# EAGLE design rfLED (EAGLE 9.2.2)
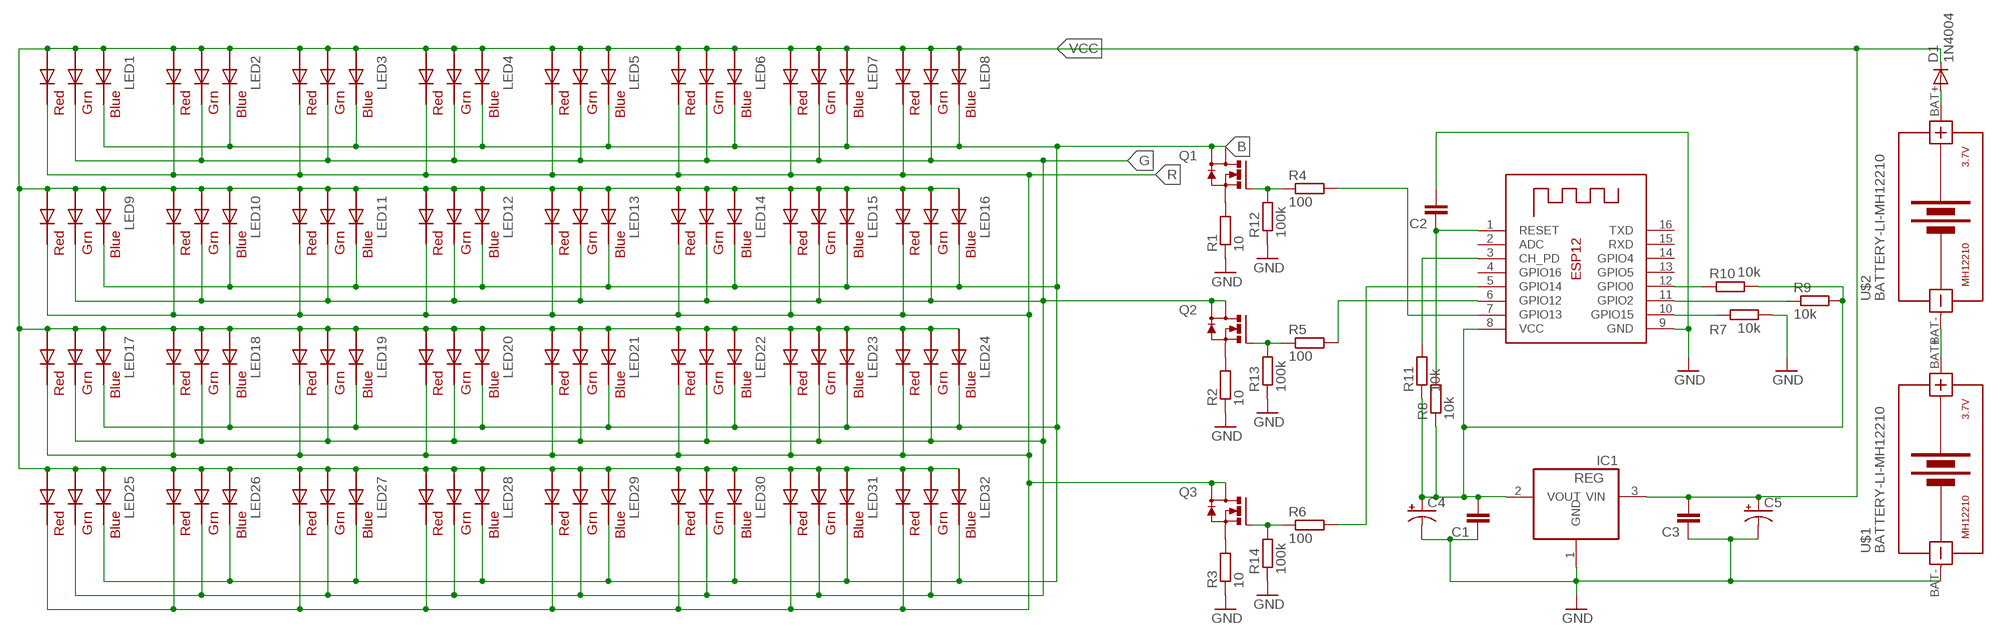
[diagram p0: schematic, sheet 1]

## Parts
C1  C  [C0805]
C2  C  [C0805]
C3  C  [C0805]
C4  CPOL-US150CLZ-1010  [150CLZ-1010]
C5  CPOL-US150CLZ-1010  [150CLZ-1010]
D1  1N4004  [DO41-10]
IC1  REG  REG1117  [SOT223]
LED1  RGBLED5050  [RGBLED5050]
LED2  RGBLED5050  [RGBLED5050]
LED3  RGBLED5050  [RGBLED5050]
LED4  RGBLED5050  [RGBLED5050]
LED5  RGBLED5050  [RGBLED5050]
LED6  RGBLED5050  [RGBLED5050]
LED7  RGBLED5050  [RGBLED5050]
LED8  RGBLED5050  [RGBLED5050]
LED9  RGBLED5050  [RGBLED5050]
LED10  RGBLED5050  [RGBLED5050]
LED11  RGBLED5050  [RGBLED5050]
LED12  RGBLED5050  [RGBLED5050]
LED13  RGBLED5050  [RGBLED5050]
LED14  RGBLED5050  [RGBLED5050]
LED15  RGBLED5050  [RGBLED5050]
LED16  RGBLED5050  [RGBLED5050]
LED17  RGBLED5050  [RGBLED5050]
LED18  RGBLED5050  [RGBLED5050]
LED19  RGBLED5050  [RGBLED5050]
LED20  RGBLED5050  [RGBLED5050]
LED21  RGBLED5050  [RGBLED5050]
LED22  RGBLED5050  [RGBLED5050]
LED23  RGBLED5050  [RGBLED5050]
LED24  RGBLED5050  [RGBLED5050]
LED25  RGBLED5050  [RGBLED5050]
LED26  RGBLED5050  [RGBLED5050]
LED27  RGBLED5050  [RGBLED5050]
LED28  RGBLED5050  [RGBLED5050]
LED29  RGBLED5050  [RGBLED5050]
LED30  RGBLED5050  [RGBLED5050]
LED31  RGBLED5050  [RGBLED5050]
LED32  RGBLED5050  [RGBLED5050]
Q1  MOSFET_N_SOT223  [SOT223]
Q2  MOSFET_N_SOT223  [SOT223]
Q3  MOSFET_N_SOT223  [SOT223]
R1  10  RR2512  [R2512]
R2  10  RR2512  [R2512]
R3  10  RR2512  [R2512]
R4  100  RR1206  [R1206]
R5  100  RR1206  [R1206]
R6  100  RR1206  [R1206]
R7  10k  RR1206  [R1206]
R8  10k  RR1206  [R1206]
R9  10k  RR1206  [R1206]
R10  10k  RR1206  [R1206]
R11  10k  RR1206  [R1206]
R12  100k  RR1206  [R1206]
R13  100k  RR1206  [R1206]
R14  100k  RR1206  [R1206]
U$1  BATTERY-LI-MH12210  [BATTERY-LI-MH12210]
U$2  BATTERY-LI-MH12210  [BATTERY-LI-MH12210]
X1  ESP-12  [ESP-12]

## Nets
B: LED1.4(BLUE_C) LED2.4(BLUE_C) LED3.4(BLUE_C) LED4.4(BLUE_C) LED5.4(BLUE_C) LED6.4(BLUE_C) LED7.4(BLUE_C) LED8.4(BLUE_C) LED9.4(BLUE_C) LED10.4(BLUE_C) LED11.4(BLUE_C) LED12.4(BLUE_C) LED13.4(BLUE_C) LED14.4(BLUE_C) LED15.4(BLUE_C) LED16.4(BLUE_C) LED17.4(BLUE_C) LED18.4(BLUE_C) LED19.4(BLUE_C) LED20.4(BLUE_C) LED21.4(BLUE_C) LED22.4(BLUE_C) LED23.4(BLUE_C) LED24.4(BLUE_C) LED25.4(BLUE_C) LED26.4(BLUE_C) LED27.4(BLUE_C) LED28.4(BLUE_C) LED29.4(BLUE_C) LED30.4(BLUE_C) LED31.4(BLUE_C) LED32.4(BLUE_C) Q1.2(D) Q1.4(D1)
G: LED1.6(GREEN_C) LED2.6(GREEN_C) LED3.6(GREEN_C) LED4.6(GREEN_C) LED5.6(GREEN_C) LED6.6(GREEN_C) LED7.6(GREEN_C) LED8.6(GREEN_C) LED9.6(GREEN_C) LED10.6(GREEN_C) LED11.6(GREEN_C) LED12.6(GREEN_C) LED13.6(GREEN_C) LED14.6(GREEN_C) LED15.6(GREEN_C) LED16.6(GREEN_C) LED17.6(GREEN_C) LED18.6(GREEN_C) LED19.6(GREEN_C) LED20.6(GREEN_C) LED21.6(GREEN_C) LED22.6(GREEN_C) LED23.6(GREEN_C) LED24.6(GREEN_C) LED25.6(GREEN_C) LED26.6(GREEN_C) LED27.6(GREEN_C) LED28.6(GREEN_C) LED29.6(GREEN_C) LED30.6(GREEN_C) LED31.6(GREEN_C) LED32.6(GREEN_C) Q2.2(D) Q2.4(D1)
GND: C1.1 C2.2 C3.1 C4.- C5.- IC1.1(GND) R1.1 R2.1 R3.1 R7.2 R12.1 R13.1 R14.1 U$1.BAT- X1.9(GND)
N$1: Q1.3(S) R1.2
N$2: Q2.3(S) R2.2
N$3: Q3.3(S) R3.2
N$4: Q1.1(G) R4.1 R12.2
N$5: Q2.1(G) R5.1 R13.2
N$6: Q3.1(G) R6.1 R14.2
N$7: R5.2 X1.6(GPIO12)
N$8: C1.2 C4.+ IC1.2(VOUT) R8.1 R9.2 R10.2 R11.1 X1.8(VCC)
N$9: R6.2 X1.5(GPIO14)
N$10: R4.2 X1.7(GPIO13)
N$11: R7.1 X1.10(GPIO15)
N$12: U$1.BAT+ U$2.BAT-
N$13: C2.1 R8.2 X1.1(RESET)
N$14: R10.1 X1.12(GPIO0)
N$15: R9.1 X1.11(GPIO2)
N$16: D1.A U$2.BAT+
N$17: R11.2 X1.3(CH_PD)
R: LED1.5(RED_C) LED2.5(RED_C) LED3.5(RED_C) LED4.5(RED_C) LED5.5(RED_C) LED6.5(RED_C) LED7.5(RED_C) LED8.5(RED_C) LED9.5(RED_C) LED10.5(RED_C) LED11.5(RED_C) LED12.5(RED_C) LED13.5(RED_C) LED14.5(RED_C) LED15.5(RED_C) LED16.5(RED_C) LED17.5(RED_C) LED18.5(RED_C) LED19.5(RED_C) LED20.5(RED_C) LED21.5(RED_C) LED22.5(RED_C) LED23.5(RED_C) LED24.5(RED_C) LED25.5(RED_C) LED26.5(RED_C) LED27.5(RED_C) LED28.5(RED_C) LED29.5(RED_C) LED30.5(RED_C) LED31.5(RED_C) LED32.5(RED_C) Q3.2(D) Q3.4(D1)
VCC: C3.2 C5.+ D1.C IC1.3(VIN) LED1.1(GREEN_A) LED1.2(RED_A) LED1.3(BLUE_A) LED2.1(GREEN_A) LED2.2(RED_A) LED2.3(BLUE_A) LED3.1(GREEN_A) LED3.2(RED_A) LED3.3(BLUE_A) LED4.1(GREEN_A) LED4.2(RED_A) LED4.3(BLUE_A) LED5.1(GREEN_A) LED5.2(RED_A) LED5.3(BLUE_A) LED6.1(GREEN_A) LED6.2(RED_A) LED6.3(BLUE_A) LED7.1(GREEN_A) LED7.2(RED_A) LED7.3(BLUE_A) LED8.1(GREEN_A) LED8.2(RED_A) LED8.3(BLUE_A) LED9.1(GREEN_A) LED9.2(RED_A) LED9.3(BLUE_A) LED10.1(GREEN_A) LED10.2(RED_A) LED10.3(BLUE_A) LED11.1(GREEN_A) LED11.2(RED_A) LED11.3(BLUE_A) LED12.1(GREEN_A) LED12.2(RED_A) LED12.3(BLUE_A) LED13.1(GREEN_A) LED13.2(RED_A) LED13.3(BLUE_A) LED14.1(GREEN_A) LED14.2(RED_A) LED14.3(BLUE_A) LED15.1(GREEN_A) LED15.2(RED_A) LED15.3(BLUE_A) LED16.1(GREEN_A) LED16.2(RED_A) LED16.3(BLUE_A) LED17.1(GREEN_A) LED17.2(RED_A) LED17.3(BLUE_A) LED18.1(GREEN_A) LED18.2(RED_A) LED18.3(BLUE_A) LED19.1(GREEN_A) LED19.2(RED_A) LED19.3(BLUE_A) LED20.1(GREEN_A) LED20.2(RED_A) LED20.3(BLUE_A) LED21.1(GREEN_A) LED21.2(RED_A) LED21.3(BLUE_A) LED22.1(GREEN_A) LED22.2(RED_A) LED22.3(BLUE_A) LED23.1(GREEN_A) LED23.2(RED_A) LED23.3(BLUE_A) LED24.1(GREEN_A) LED24.2(RED_A) LED24.3(BLUE_A) LED25.1(GREEN_A) LED25.2(RED_A) LED25.3(BLUE_A) LED26.1(GREEN_A) LED26.2(RED_A) LED26.3(BLUE_A) LED27.1(GREEN_A) LED27.2(RED_A) LED27.3(BLUE_A) LED28.1(GREEN_A) LED28.2(RED_A) LED28.3(BLUE_A) LED29.1(GREEN_A) LED29.2(RED_A) LED29.3(BLUE_A) LED30.1(GREEN_A) LED30.2(RED_A) LED30.3(BLUE_A) LED31.1(GREEN_A) LED31.2(RED_A) LED31.3(BLUE_A) LED32.1(GREEN_A) LED32.2(RED_A) LED32.3(BLUE_A)
Unconnected: X1.2(ADC) X1.4(GPIO16) X1.13(GPIO5) X1.14(GPIO4) X1.15(RXD) X1.16(TXD)

## Library data of the parts
C1-C3 = eagle-ltspice:C: CAPACITOR, European symbol; SPICEMODEL: NONE; SPICEPREFIX: C
C4 C5 = adafruit:CPOL-US: POLARIZED CAPACITOR, American symbol
D1 = adafruit:1N4004: DIODE General purpose 1N400x type rectifier (With bigger pads) http://www.ladyada.net/library/pcb/eaglelibrary.html
IC1 = burr-brown:REG1117: 800mA and 1A Low Dropout (LDO) Positive Regulator 1.8V, 2.5V, 2.85V, 3.3V, 5V, and Adj; MPN: REG1117; OC_FARNELL: 1097566; OC_NEWARK: 14P6981
LED1-LED32 = adafruit:RGBLED: For 5050 RGB LEDs, the order of the LEDs may vary from one manufacturer to another!
Q1-Q3 = m-pad-2.1:MOSFET_N_SOT223: n channel mosfets in the sot-223 package standard pinout ie. fairchildsemi.com: IRFL4105 NDT451AN NDT455N FDT439N FQT13N06L etc. digikey: NDT451ANCT-ND (good, cheap one from natsemi)
R1-R14 = eagle-ltspice:R: RESISTOR, European symbol; SPICEMODEL: NONE; SPICEPREFIX: R
U$1 U$2 = diy-modules:BATTERY-LI-MH12210: Lithium-Ion MH12210 Rechargeable Battery Panasonic NCR18650PF battery datasheet available here: https://industrial.panasonic.com/cdbs/www-data/pdf2/ACI4000/ACI4000C12.pdf Click here to find device on ebay.com <http://www.ebay.com/sch/ncr18650b+battery>
X1 = adafruit:ESP-12

## Board
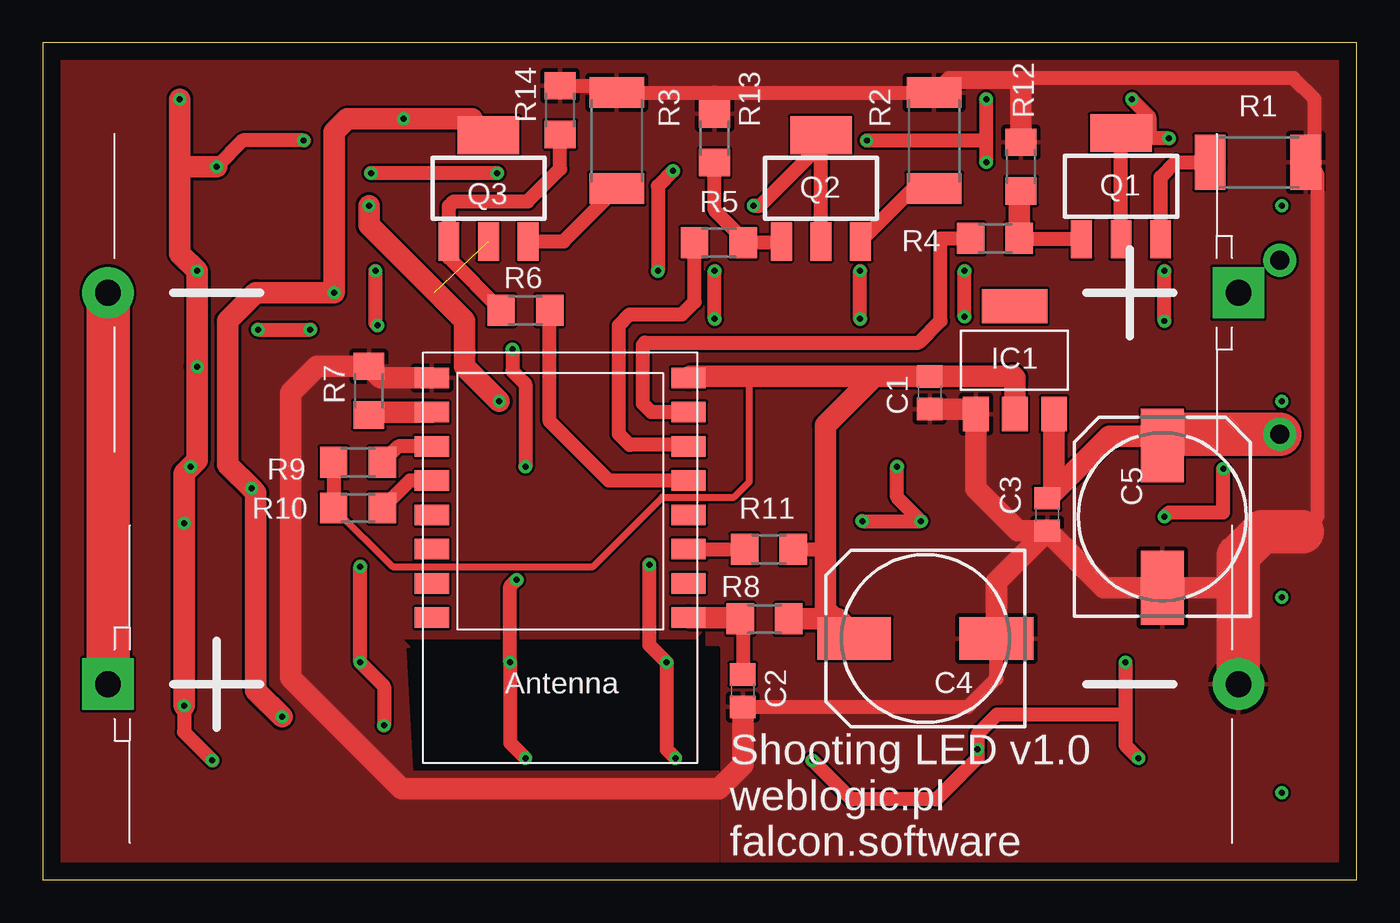
[diagram p1: board, top side]
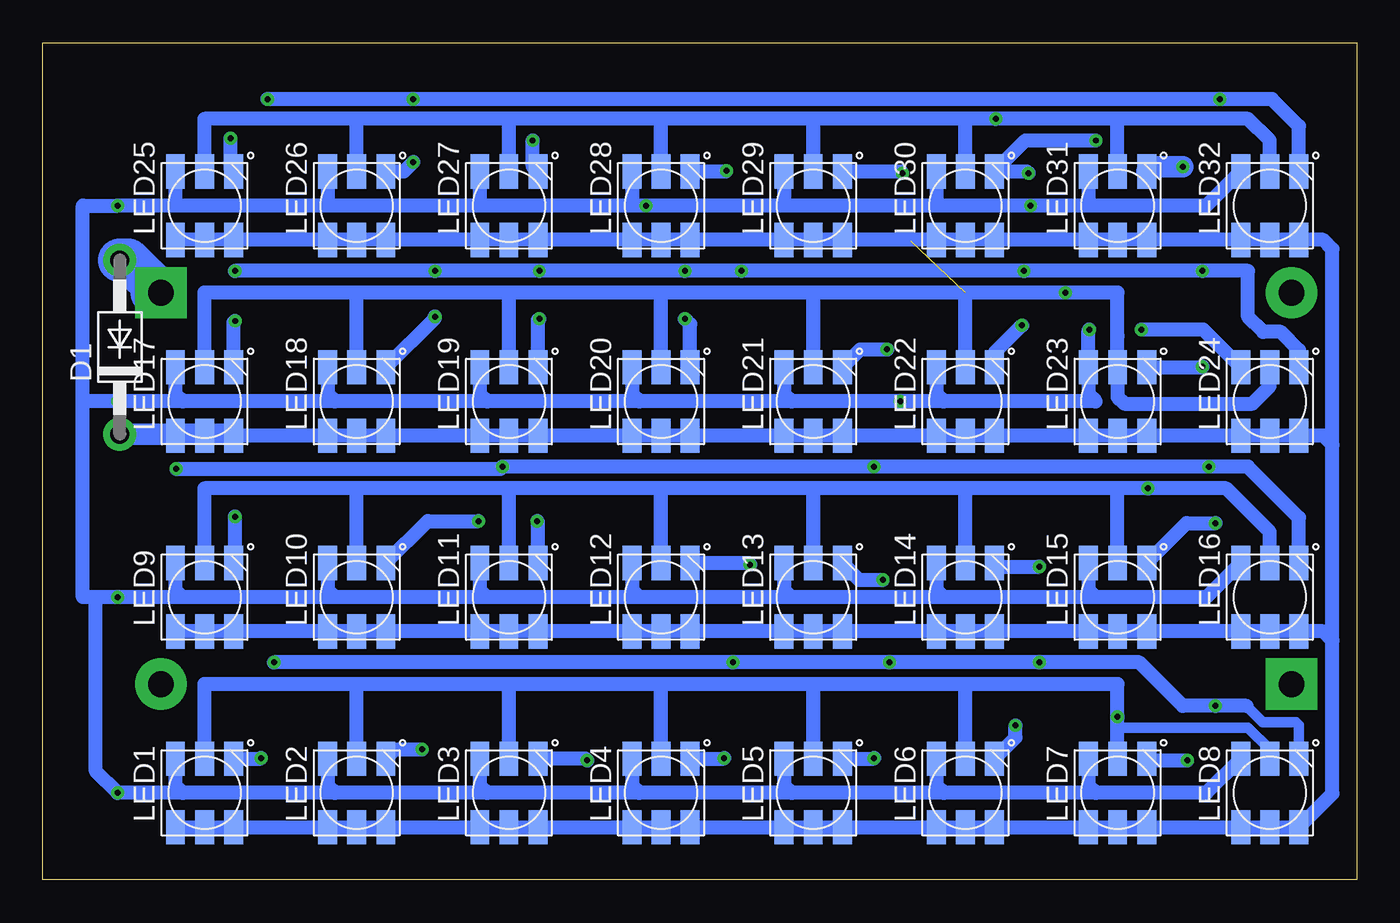
[diagram p2: board, bottom side, seen from below]

Size 76.76 x 48.88 mm. Coordinates in mm from the lower left corner, seen from the top.
Outline: 0,0 76.76,0 76.76,48.88 0,48.88 0,0
Copper layers (1*16): Top 0.035mm / dielectric 1.5mm / Bottom 0.035mm
Design rules "default": minimum track width 6mil, minimum drill 0.35mm, track to track 6mil, track to pad 6mil, pad to pad 6mil, via to via 6mil, smd to smd 6mil, copper to edge 40mil, drill to drill 6mil, minimum pad ring 10mil, minimum via ring 8mil, stop-mask expansion 4mil, vias tented up to drill 0mil, thermal gap 10mil

### Footprints (pad centres in the part's own frame; a part is rotated, then mirrored left to right if it is on the bottom)
C0805 = smd 1.3 x 1.5: 1 -0.95,0; 2 0.95,0
150CLZ-1010 = smd 4.3 x 2.5: + 4.15,0; - -4.15,0
DO41-10 = drill 1.118 pad 1.93: A 5.08,0; C -5.08,0
SOT223 = smd 1.499 x 2.007: 1 -2.261,-3.15; 2 0.025,-3.15; 3 2.311,-3.15 | smd 3.81 x 2.007: 4 0,3.15
RGBLED5050 = smd 2 x 1.1: 1 -2,1.7; 2 -2,0; 3 -2,-1.7; 4 2,-1.7; 5 2,0; 6 2,1.7
SOT223' = smd 1.219 x 2.235: 1 -2.311,-3.099; 2 0,-3.099; 3 2.311,-3.099 | smd 3.6 x 2.2: 4 0,3.099
R2512 = smd 1.8 x 3.2: 1 -2.8,0; 2 2.8,0
R1206 = smd 1.6 x 1.803: 1 -1.422,0; 2 1.422,0
BATTERY-LI-MH12210 = drill 1.5 pad 3 square: BAT+ -33.02,0 | drill 1.5 pad 3: BAT- 33.02,0
ESP-12 = smd 2 x 1.2: 1 -7.5,4.5; 2 -7.5,2.5; 3 -7.5,0.5; 4 -7.5,-1.5; 5 -7.5,-3.5; 6 -7.5,-5.5; 7 -7.5,-7.5; 8 -7.5,-9.5; 9 7.5,-9.5; 10 7.5,-7.5; 11 7.5,-5.5; 12 7.5,-3.5; 13 7.5,-1.5; 14 7.5,0.5; 15 7.5,2.5; 16 7.5,4.5

### Placement (x,y rotation side)
C1  51.82,28.45 90 top
C2  40.89,11.05 270 top
C3  58.67,21.34 90 top
C4  51.56,14.1 180 top
C5  65.41,21.21 90 top
D1  72.26,31.11 90 bottom
IC1  56.77,30.35 0 top
LED1  67.31,5.08 90 bottom
LED2  58.42,5.08 90 bottom
LED3  49.53,5.08 90 bottom
LED4  40.64,5.08 90 bottom
LED5  31.75,5.08 90 bottom
LED6  22.86,5.08 90 bottom
LED7  13.97,5.08 90 bottom
LED8  5.08,5.08 90 bottom
LED9  67.31,16.51 90 bottom
LED10  58.42,16.51 90 bottom
LED11  49.53,16.51 90 bottom
LED12  40.64,16.51 90 bottom
LED13  31.75,16.51 90 bottom
LED14  22.86,16.51 90 bottom
LED15  13.97,16.51 90 bottom
LED16  5.08,16.51 90 bottom
LED17  67.31,27.94 90 bottom
LED18  58.42,27.94 90 bottom
LED19  49.53,27.94 90 bottom
LED20  40.64,27.94 90 bottom
LED21  31.75,27.94 90 bottom
LED22  22.86,27.94 90 bottom
LED23  13.97,27.94 90 bottom
LED24  5.08,27.94 90 bottom
LED25  67.31,39.37 90 bottom
LED26  58.42,39.37 90 bottom
LED27  49.53,39.37 90 bottom
LED28  40.64,39.37 90 bottom
LED29  31.75,39.37 90 bottom
LED30  22.86,39.37 90 bottom
LED31  13.97,39.37 90 bottom
LED32  5.08,39.37 90 bottom
Q1  [SOT223']  62.99,40.51 0 top
Q2  [SOT223']  45.47,40.39 0 top
Q3  [SOT223']  26.04,40.39 0 top
R1  70.99,41.91 180 top
R2  52.07,43.18 270 top
R3  33.53,43.18 270 top
R4  55.63,37.47 180 top
R5  39.5,37.21 180 top
R6  28.19,33.27 0 top
R7  19.05,28.57 90 top
R8  42.16,15.24 180 top
R9  18.41,24.38 180 top
R10  18.41,21.72 180 top
R11  42.42,19.3 180 top
R12  57.15,41.66 270 top
R13  39.24,43.31 270 top
R14  30.23,44.96 270 top
U$1  36.83,11.43 0 top
U$2  36.83,34.29 180 top
X1  30.23,19.81 180 top

### Tracks (layer width: path | path; a pad name or v marks a point on that pad's centre or on a via)
B  (via drill 0.35)
  Top 0.813: 63.88,43.61 Q1.4 Q1.2 | 63.88,43.61 64.64,43.61 64.64,44.58 v63.63,45.59 | v8.26,10.16 8.26,8.64 v9.91,6.99 | v18.54,18.29 v18.54,12.7 19.94,11.3 v19.94,9.02 | v27.69,17.53 27.3,17.14 v27.3,12.7 27.3,8 v28.19,7.11 | v36.96,7.11 36.45,7.62 v36.45,12.7 35.43,13.72 v35.43,18.41 | v63.25,12.7 63.25,9.65 | 63.25,9.65 63.25,7.87 v64.01,7.11 | 63.25,9.65 55.75,9.65 54.61,8.51 v54.61,7.62 54.61,7.11 52.2,4.7 47.24,4.7 v44.96,6.99 | v47.88,20.95 v51.31,20.95 49.91,22.35 v49.91,24.13 | v65.53,21.21 65.79,21.46 68.96,21.46 v68.96,24 | v47.75,32.77 v47.75,35.56 | v53.85,32.89 v53.85,35.56 | v39.24,32.77 v39.24,35.56 | v65.53,32.64 v65.53,35.56 | v65.79,43.31 64.19,43.31 63.88,43.61 | v55.12,41.91 55.12,43.18 | 55.12,43.18 v55.12,45.59 | v48.13,43.18 55.12,43.18 | v27.43,30.99 27.43,29.72 28.19,28.96 v28.19,24.13 | v19.56,32.38 19.43,32.51 v19.43,35.56 | v36.83,41.4 35.94,40.51 v35.94,35.56 | v15.24,43.18 11.68,43.18 v10.16,41.66 | v26.54,41.27 v19.18,41.27
  Top 1.27: v8,45.59 8,41.66 | 8,41.66 8,36.58 v9.02,35.56 v9.02,29.97 9.02,24.51 v8.64,24.13 8.26,23.75 v8.26,20.83 v8.26,10.16 | 8,41.66 v10.16,41.66
  Bottom 0.61: LED8.4 3.38,9.04 3.56,9.22 5.5,9.22 6.44,10.16
  Bottom 0.813: LED16.4 3.38,21.16 6.35,24.13 v8.64,24.13 v28.19,24.13 v49.91,24.13 50.04,24 v68.96,24 | 3.38,30.05 LED24.4 3.38,30.94 4.45,32 5.46,32 6.35,32.89 6.35,35.56 v9.02,35.56 v19.43,35.56 v35.94,35.56 v39.24,35.56 v47.75,35.56 v53.85,35.56 v65.53,35.56 | LED32.4 3.38,44.02 4.95,45.59 v8,45.59 v55.12,45.59 v63.63,45.59 | 6.44,10.16 v8.26,10.16 10.16,10.16 12.7,12.7 v18.54,12.7 v27.3,12.7 v36.45,12.7 v63.25,12.7 | LED7.4 12.18,6.99 v9.91,6.99 | LED15.4 9.95,20.83 v8.26,20.83 | LED5.4 28.23,7.08 v28.19,7.11 | LED4.4 36.99,7.08 v36.96,7.11 | LED13.4 29.07,17.53 v27.69,17.53 | LED14.4 20.94,18.29 v18.54,18.29 | LED6.4 19.94,8.3 v19.94,9.02 | LED2.4 56.18,7.62 v54.61,7.62 | v44.96,6.99 45.05,7.08 LED3.4 | LED1.4 64.04,7.08 v64.01,7.11 | LED9.4 65.53,18.59 v65.53,21.21 | LED12.4 35.53,18.51 v35.43,18.41 | LED11.4 47.83,20.91 v47.88,20.95 | LED10.4 54.27,20.95 v51.31,20.95 | LED23.4 9.05,29.94 v9.02,29.97 | LED22.4 21.16,30.78 v19.56,32.38 | LED21.4 29,30.99 v27.43,30.99 | LED20.4 38.94,32.46 v39.24,32.77 | LED19.4 47.83,32.69 v47.75,32.77 | LED18.4 53.85,32.81 v53.85,32.89 | LED17.4 65.61,32.56 v65.53,32.64 | LED25.4 65.79,41.55 v65.79,43.31 | LED26.4 55.66,41.37 v55.12,41.91 | LED27.4 48.13,41.67 v48.13,43.18 | LED28.4 36.86,41.37 v36.83,41.4 | v15.24,43.18 19.35,43.18 LED30.4 19.27,41.37 v19.18,41.27 | LED29.4 26.64,41.37 v26.54,41.27
  Bottom 1.27: LED31.4 11.98,41.66 v10.16,41.66
G  (via drill 0.35)
  Top 0.813: 45.47,42.93 41.91,39.37 v41.53,39.37 | Q2.4 45.47,42.93 | Q2.2 45.47,42.93 | v12.57,32.13 v15.62,32.13
  Top 1.27: v26.67,27.94 24.64,29.97 24.64,32.64 19.05,38.23 v19.05,39.37
  Bottom 0.813: LED8.6 8.78,5.08 15.24,5.08 | 15.24,5.08 24.13,5.08 | 24.13,5.08 33.02,5.08 | 33.02,5.08 41.91,5.08 | 41.91,5.08 50.8,5.08 | 50.8,5.08 59.69,5.08 | 59.69,5.08 68.58,5.08 | 68.58,5.08 v72.39,5.08 73.66,6.35 73.66,16.51 | LED1.6 69.01,5.51 68.58,5.08 | LED2.6 60.12,5.51 59.69,5.08 | LED3.6 51.23,5.51 50.8,5.08 | LED4.6 42.34,5.51 41.91,5.08 | LED5.6 33.45,5.51 33.02,5.08 | LED6.6 24.56,5.51 24.13,5.08 | LED7.6 15.67,5.51 15.24,5.08 | LED16.6 8.78,16.51 15.24,16.51 | 15.24,16.51 24.13,16.51 | 24.13,16.51 33.02,16.51 | 33.02,16.51 41.91,16.51 | 41.91,16.51 50.8,16.51 | 50.8,16.51 59.69,16.51 | 59.69,16.51 68.58,16.51 | 68.58,16.51 v72.39,16.51 73.66,16.51 | LED15.6 15.67,16.94 15.24,16.51 | LED14.6 24.56,16.94 24.13,16.51 | LED13.6 33.45,16.94 33.02,16.51 | LED12.6 42.34,16.94 41.91,16.51 | LED11.6 51.23,16.94 50.8,16.51 | LED10.6 60.12,16.94 59.69,16.51 | LED9.6 69.01,16.94 68.58,16.51 | 24.13,27.94 15.24,27.94 15.67,28.37 LED23.6 15.67,32.08 v15.62,32.13 | 24.13,27.94 v26.67,27.94 33.02,27.94 | 33.02,27.94 41.91,27.94 | 41.91,27.94 50.8,27.94 | 50.8,27.94 59.69,27.94 | 59.69,27.94 68.58,27.94 | 68.58,27.94 v72.39,27.94 74.42,27.94 | LED22.6 24.56,28.37 24.13,27.94 | LED21.6 33.45,28.37 33.02,27.94 | LED20.6 42.34,28.37 41.91,27.94 | LED19.6 51.23,28.37 50.8,27.94 | LED18.6 60.12,28.37 59.69,27.94 | LED17.6 69.01,28.37 68.58,27.94 | LED32.6 8.78,39.37 15.62,39.37 | 15.62,39.37 v19.05,39.37 24.64,39.37 | 24.64,39.37 33.4,39.37 | 33.4,39.37 v41.53,39.37 42.29,39.37 | 42.29,39.37 51.18,39.37 | 51.18,39.37 60.07,39.37 | 60.07,39.37 68.71,39.37 | 68.71,39.37 v72.39,39.37 74.42,39.37 74.42,27.94 | 74.42,27.94 74.42,16.51 73.66,16.51 | LED31.6 15.67,39.42 15.62,39.37
  Bottom 0.813: LED30.6 24.56,39.45 24.64,39.37 | LED29.6 33.45,39.42 33.4,39.37 | LED28.6 42.34,39.42 42.29,39.37 | LED27.6 51.23,39.42 51.18,39.37 | LED26.6 60.12,39.42 60.07,39.37 | LED25.6 69.01,39.67 68.71,39.37 | LED24.6 8.97,32.13 v12.57,32.13
GND
  Top 0.813: 73.58,20.32 74.45,21.18 74.45,41.26 R1.1 74.3,41.91 74.3,45.59 73.06,46.83 52.92,46.83 R2.1 | 39.24,45.98 R3.1 33.13,46.38 R14.1 | 39.24,45.98 R2.1 | C2.2 54.04,10.1 55.71,11.77 C4.- | R13.1 39.24,45.98 | R2.1 52.69,46.6 57.15,46.6
  Top 1.27: U$1.BAT- 69.85,16.38 69.17,17.06 C5.- 62,17.06 C3.1 | C3.1 56.96,20.39 54.51,22.84 IC1.1 54.21,27.5 C1.1 | C3.1 55.71,17.42 C4.- | X1.9 19.73,29.31 R7.2 16.03,30 14.48,28.45 14.48,11.81 20.95,5.33 39.5,5.33 40.89,6.73 C2.2 | 57.15,46.6 R12.1
  Top 2.54: U$1.BAT- 69.85,18.92 71.25,20.32 73.58,20.32
  pour Top: 0,48.9 76.83,48.9 76.83,0 39.62,0 39.62,13.59 39.5,13.72 38.73,13.72 38.73,14.73 38.1,14.1 21.08,14.1 21.08,13.97 21.46,13.59 21.21,13.59 21.59,6.35 39.51,6.35 39.5,-0.2 0,0.13
N$1
  Top 0.813: 65.3,38.51 Q1.3 65.3,41.05 66.17,41.91 68.7,41.91
N$2
  Top 0.813: Q2.3 50.87,40.38 R2.2
N$3
  Top 0.813: Q3.3 30.43,37.29 R3.2
N$4
  Top 0.813: Q1.1 57.1,37.41 R4.1
  Top 1.27: R4.1 57.05,40.13 R12.2
N$5
  Top 0.813: Q2.1 43.08,37.21 R5.1 40.92,37.44 39.24,39.12 R13.2
N$6
  Top 0.813: R6.1 23.72,36.32 Q3.1 23.72,39.34 24,39.62 28.32,39.62 30.23,41.53 R14.2
N$7
  Top 0.813: X1.6 37.64,25.4 34.29,25.4 33.66,26.04 33.66,32.38 34.29,33.02 37.34,33.02 38.08,33.76 R5.2
N$8
  Top 0.406: R10.2 20.42,18.29 32.13,18.29 36.2,22.35 40.39,22.35 41.27,23.24 41.27,29.4
  Top 0.813: R9.2 R10.2 | R11.1 45.72,19.3 45.59,19.43
  Top 1.27: IC1.2 56.79,29.31 56.64,29.46 56.58,29.4 C1.2 48.58,29.4 | 48.58,29.4 45.72,26.54 45.72,19.3 45.72,15.79 C4.+ 47.5,14.18 46.44,15.24 R8.1 | 48.58,29.4 41.27,29.4 37.81,29.4 X1.8
N$9
  Top 0.813: X1.5 33.08,23.31 29.62,26.77 R6.2
N$10
  Top 0.813: X1.7 35.55,27.31 35.05,27.81 35.05,31.24 35.18,31.37 51.18,31.37 52.45,32.64 52.45,37.47 R4.2
N$11
  Top 1.27: X1.10 19.21,27.31 R7.1
N$12
  Top 2.54: U$2.BAT- U$1.BAT+
N$13
  Top 0.813: R8.2 40.89,15.09 C2.1
  Top 1.27: X1.1 40.67,15.31 R8.2
N$14
  Top 0.813: X1.12 21.43,23.31 R10.1
N$15
  Top 0.813: X1.11 20.77,25.31 R9.1
N$16
  Bottom 2.54: 70.36,34.29 U$2.BAT+ 71.75,36.2 D1.A
N$17
  Top 0.813: X1.3 40.99,19.31 R11.2
R  (via drill 0.35)  (1 unrouted)
  Top 0.813: 25.07,44.45 Q3.4
  Top 1.27: 25.07,44.45 v21.08,44.45 17.78,44.45 17.02,43.69 v17.02,34.29 12.45,34.29 10.79,32.64 10.79,24.26 v12.19,22.86 12.45,22.61 12.45,11.05 v13.97,9.53
  Bottom 0.61: LED8.5 5.08,7.62 6.35,8.89 13.97,8.89 | 13.95,31.73 13.97,31.75
  Bottom 0.813: 22.86,11.43 13.97,11.43 v13.97,9.53 13.97,8.89 LED7.5 | 22.86,11.43 31.75,11.43 | 31.75,11.43 40.64,11.43 | 40.64,11.43 49.53,11.43 | 49.53,11.43 58.42,11.43 | 58.42,11.43 67.31,11.43 LED1.5 | LED6.5 22.86,11.43 | LED5.5 31.75,11.43 | LED4.5 40.64,11.43 | LED3.5 49.53,11.43 | LED2.5 58.42,11.43 | 22.86,34.29 v17.02,34.29 13.97,34.29 13.97,31.75 LED23.5 13.97,28.19 13.59,27.81 6.1,27.81 5.08,28.83 LED24.5 | 22.86,34.29 31.75,34.29 | 31.75,34.29 40.64,34.29 | 40.64,34.29 49.53,34.29 | 49.53,34.29 58.42,34.29 | 58.42,34.29 67.31,34.29 LED17.5 | LED16.5 5.08,20.32 7.62,22.86 v12.19,22.86 13.97,22.86 | 13.97,22.86 22.86,22.86 | 22.86,22.86 31.75,22.86 | 31.75,22.86 40.64,22.86 | 40.64,22.86 49.53,22.86 | 49.53,22.86 58.42,22.86 | 58.42,22.86 67.31,22.86 LED9.5 | LED15.5 13.97,22.86 | LED14.5 22.86,22.86 | LED13.5 31.75,22.86 | LED12.5 40.64,22.86 | LED11.5 49.53,22.86 | LED10.5 58.42,22.86 | LED22.5 22.86,34.29 | LED21.5 31.75,34.29 | LED20.5 40.64,34.29 | LED19.5 49.53,34.29 | LED18.5 58.42,34.29 | LED32.5 5.08,43.18 6.35,44.45 13.97,44.45 | 13.97,44.45 v21.08,44.45 22.86,44.45 | 22.86,44.45 31.75,44.45 | 31.75,44.45 40.64,44.45 | 40.64,44.45 49.53,44.45 | 49.53,44.45 58.42,44.45 | 58.42,44.45 67.31,44.45 LED25.5 | LED31.5 13.97,44.45 | LED30.5 22.86,44.45 | LED29.5 31.75,44.45 | LED28.5 40.64,44.45 | LED27.5 49.53,44.45 | LED26.5 58.42,44.45
VCC
  Top 1.27: D1.C 69.11,26.04 | 65.79,26.04 65.66,25.91 | 65.66,25.91 65.66,25.61 C5.+ | 65.66,25.91 62.3,25.91 C3.2 59.08,22.69 IC1.3
  Top 2.54: C5.+ 66.08,26.04 D1.C
  Bottom 0.813: LED1.1 LED1.2 LED1.3 LED2.1 LED2.2 LED2.3 LED3.1 LED3.2 LED3.3 LED4.1 LED4.2 LED4.3 LED5.1 LED5.2 LED5.3 LED6.1 LED6.2 LED6.3 LED7.1 LED7.2 LED7.3 LED8.1 LED8.2 LED8.3 1.42,5.04 1.42,13.97 | 1.42,13.97 1.42,25.4 | 1.42,25.4 1.42,36.83 1.96,37.37 LED32.3 LED32.2 LED32.1 LED31.3 LED31.2 LED31.1 LED30.3 LED30.2 LED30.1 LED29.3 LED29.2 LED29.1 LED28.3 LED28.2 LED28.1 LED27.3 LED27.2 LED27.1 LED26.3 LED26.2 LED26.1 LED25.3 LED25.2 LED25.1 | 1.42,25.4 1.96,25.94 LED24.3 LED24.2 LED24.1 LED23.3 LED23.2 LED23.1 LED22.3 LED22.2 LED22.1 LED21.3 LED21.2 LED21.1 LED20.3 LED20.2 LED20.1 LED19.3 LED19.2 LED19.1 LED18.3 LED18.2 LED18.1 LED17.3 LED17.2 LED17.1 | 1.42,13.97 1.96,14.51 LED16.3 LED16.2 LED16.1 LED15.3 LED15.2 LED15.1 LED14.3 LED14.2 LED14.1 LED13.3 LED13.2 LED13.1 LED12.3 LED12.2 LED12.1 LED11.3 LED11.2 LED11.1 LED10.3 LED10.2 LED10.1 LED9.3 LED9.2 LED9.1
  Bottom 1.27: 69.11,26.04 LED17.1 | D1.C 69.11,26.04 | 69.11,26.04 65.79,26.04

### Text on the board
tNames: Shooting LED v1.0 / weblogic.pl / falcon.software